# Altium schematic sheet preamp.SchDoc
size B
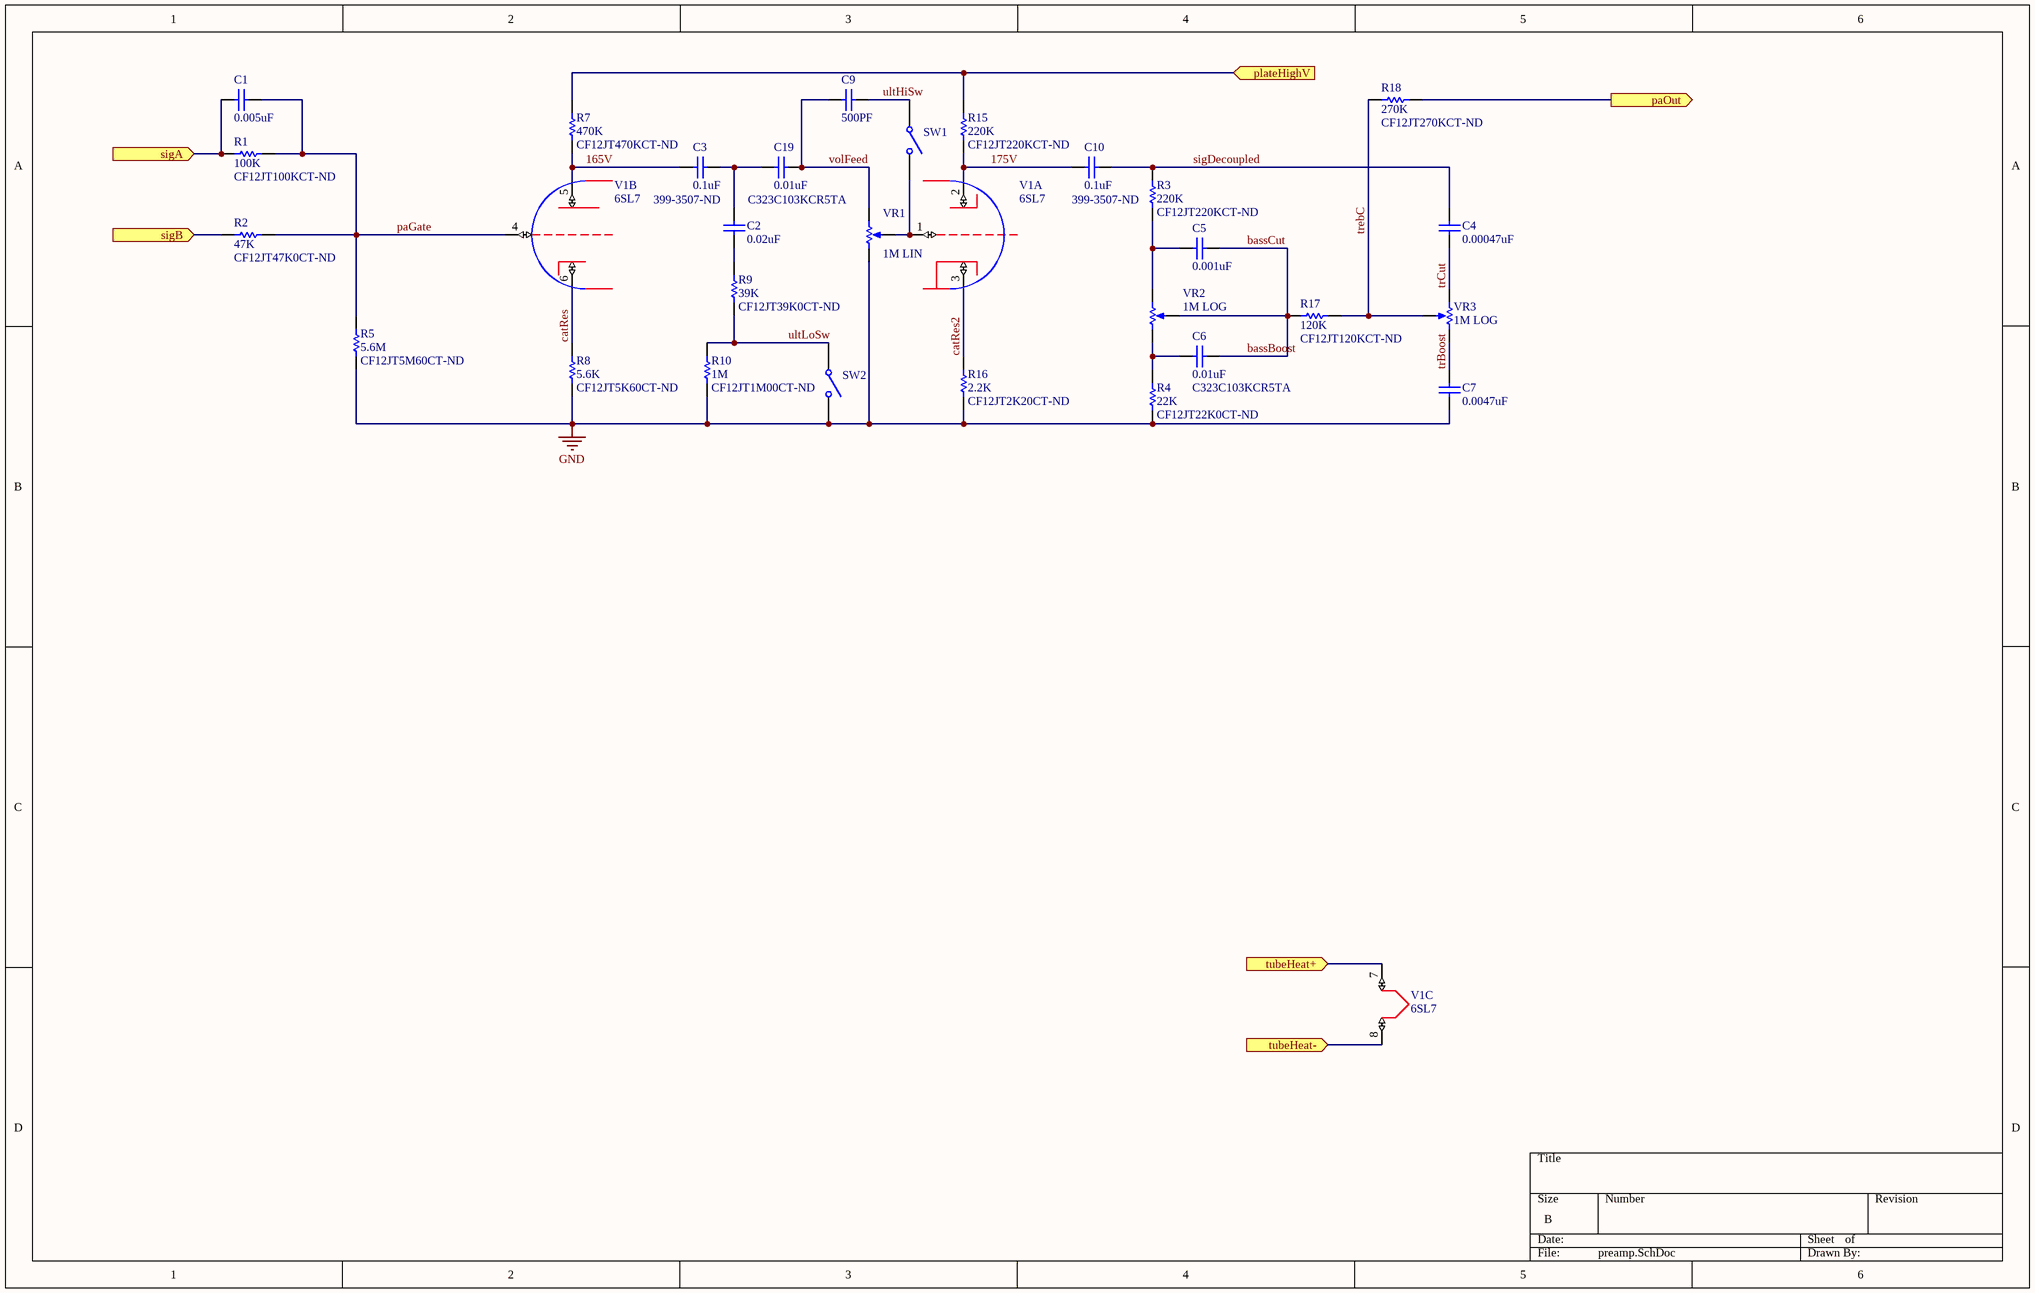
[diagram p0: preamp.SchDoc]

## Parts
C1  value 0.005uF  [RAD-0.3]  (hidden comment: Cap)
C2  value 0.02uF  [RAD-0.3]  (hidden comment: Cap)
C3  value 0.1uF  Supplier Part Number 1: 399-3507-ND  [RAD-0.3]  (hidden comment: Cap)
C4  value 0.00047uF  [RAD-0.3]  (hidden comment: Cap)
C5  value 0.001uF  [RAD-0.3]  (hidden comment: Cap)
C6  value 0.01uF  Supplier Part Number 1: C323C103KCR5TA  [RAD-0.3]  (hidden comment: Cap)
C7  value 0.0047uF  [RAD-0.3]  (hidden comment: Cap)
C9  value 500PF  [RAD-0.3]  (hidden comment: Cap)
C10  value 0.1uF  Supplier Part Number 1: 399-3507-ND  [RAD-0.3]  (hidden comment: Cap)
C19  value 0.01uF  Supplier Part Number 1: C323C103KCR5TA  [RAD-0.3]  (hidden comment: Cap)
R1  value 100K  Supplier Part Number 1: CF12JT100KCT-ND  [AXIAL-0.3]  (hidden comment: Res1)
R2  value 47K  Supplier Part Number 1: CF12JT47K0CT-ND  [AXIAL-0.3]  (hidden comment: Res1)
R3  value 220K  Supplier Part Number 1: CF12JT220KCT-ND  [AXIAL-0.3]  (hidden comment: Res1)
R4  value 22K  Supplier Part Number 1: CF12JT22K0CT-ND  [AXIAL-0.3]  (hidden comment: Res1)
R5  value 5.6M  Supplier Part Number 1: CF12JT5M60CT-ND  [AXIAL-0.3]  (hidden comment: Res1)
R7  value 470K  Supplier Part Number 1: CF12JT470KCT-ND  [AXIAL-0.3]  (hidden comment: Res1)
R8  value 5.6K  Supplier Part Number 1: CF12JT5K60CT-ND  [AXIAL-0.3]  (hidden comment: Res1)
R9  value 39K  Supplier Part Number 1: CF12JT39K0CT-ND  [AXIAL-0.3]  (hidden comment: Res1)
R10  value 1M  Supplier Part Number 1: CF12JT1M00CT-ND  [AXIAL-0.3]  (hidden comment: Res1)
R15  value 220K  Supplier Part Number 1: CF12JT220KCT-ND  [AXIAL-0.3]  (hidden comment: Res1)
R16  value 2.2K  Supplier Part Number 1: CF12JT2K20CT-ND  [AXIAL-0.3]  (hidden comment: Res1)
R17  value 120K  Supplier Part Number 1: CF12JT120KCT-ND  [AXIAL-0.3]  (hidden comment: Res1)
R18  value 270K  Supplier Part Number 1: CF12JT270KCT-ND  [AXIAL-0.3]  (hidden comment: Res1)
SW1  SW-SPST  [SPST-2]  (value not drawn)
SW2  SW-SPST  [SPST-2]  (value not drawn)
V1  6SL7  [OCTALSOCKET]  (parts A,B,C of 3)
VR1  value 1M LIN  [VR5]  (hidden comment: RPot)
VR2  value 1M LOG  [VR5]  (hidden comment: RPot)
VR3  value 1M LOG  [VR5]  (hidden comment: RPot)

## Ports
paOut (out), plateHighV (in), sigA (in), sigB (in), tubeHeat+ (in), tubeHeat- (in)

## Nets
GND: C7.1 R4.1 R5.1 R8.1 R10.1 R16.1 SW2.2(NO) VR1.1(TOP)
165V: C3.1 R7.1 V1.5(topPlate)
175V: C10.1 R15.1 V1.2(topPlate)
bassBoost: C5.2 C6.2 R17.1 VR2.3(TAP)  [also labelled bassCut]
catRes: R8.2 V1.6(topPlate)
catRes2: R16.2 V1.3(topPlate)
paGate: C1.1 R1.2 R2.2 R5.2 V1.4(gate)
paOut: R18.2 ; port paOut
plateHighV: R7.2 R15.2 ; port plateHighV
sigA: C1.2 R1.1 ; port sigA
sigB: R2.1 ; port sigB
sigDecoupled: C4.2 C10.2 R3.2
trBoost: C7.2 VR3.2(BOT)
trCut: C4.1 VR3.1(TOP)
trebC: R17.2 R18.1 VR3.3(TAP)
tubeHeat+: V1.7 ; port tubeHeat+
tubeHeat-: V1.8 ; port tubeHeat-
ultHiSw: C9.1 SW1.1(COMMON)
ultLoSw: R9.1 R10.2 SW2.1(COMMON)
volFeed: C9.2 C19.2 VR1.2(BOT)
NetC2_1: C2.1 R9.2
NetC2_2: C2.2 C3.2 C19.1
NetC5_1: C5.1 R3.1 VR2.2(BOT)
NetC6_1: C6.1 R4.2 VR2.1(TOP)
NetSW1_2: SW1.2(NO) V1.1(gate) VR1.3(TAP)

## Library data of the parts
C1-C7 C9 C10 C19 = Cap: Capacitor; Published: 8-Jun-2000; LatestRevisionDate: 17-Jul-2002; LatestRevisionNote: Re-released for DXP Platform.; PackageReference: RAD-0.3; Publisher: Altium Limited; PackageDescription: Radial Cap, Thru-Hole; 2 Leads; 0.3 in Pin Spacing
  C3 C6 C10 C19: Supplier 1: Digi-Key
R1-R5 R7-R10 R15-R18 = Res1: Resistor; Published: 8-Jun-2000; LatestRevisionDate: 17-Jul-2002; LatestRevisionNote: Re-released for DXP Platform.; PackageReference: AXIAL-0.3; Publisher: Altium Limited; PackageDescription: Axial Device, Thru-Hole; 2 Leads; 0.3 in Pin Spacing; Supplier 1: Digi-Key
SW1 SW2 = SW-SPST: Single-Pole, Single-Throw Switch; Published: 24-Mar-1999; LatestRevisionDate: 17-Jul-2002; LatestRevisionNote: Re-released for DXP Platform.; PackageReference: SPST-2; Publisher: Altium Limited; PackageDescription: Switch; 2 Leads
VR1-VR3 = RPot: Potentiometer; Sim Note: Enter the Resistance value and the set point into parameter fields.; Set Position: 0.5; Published: 8-Jun-2000; LatestRevisionDate: 17-Jul-2002; LatestRevisionNote: Re-released for DXP Platform.; PackageReference: VR5; Publisher: Altium Limited; PackageDescription: Variable Resistor, Thru-Hole; 3 Leads